# EAGLE design SparkFun_6DoF_ISM330DHCX_Qwiic_Micro_Alternate (EAGLE 9.6.2)
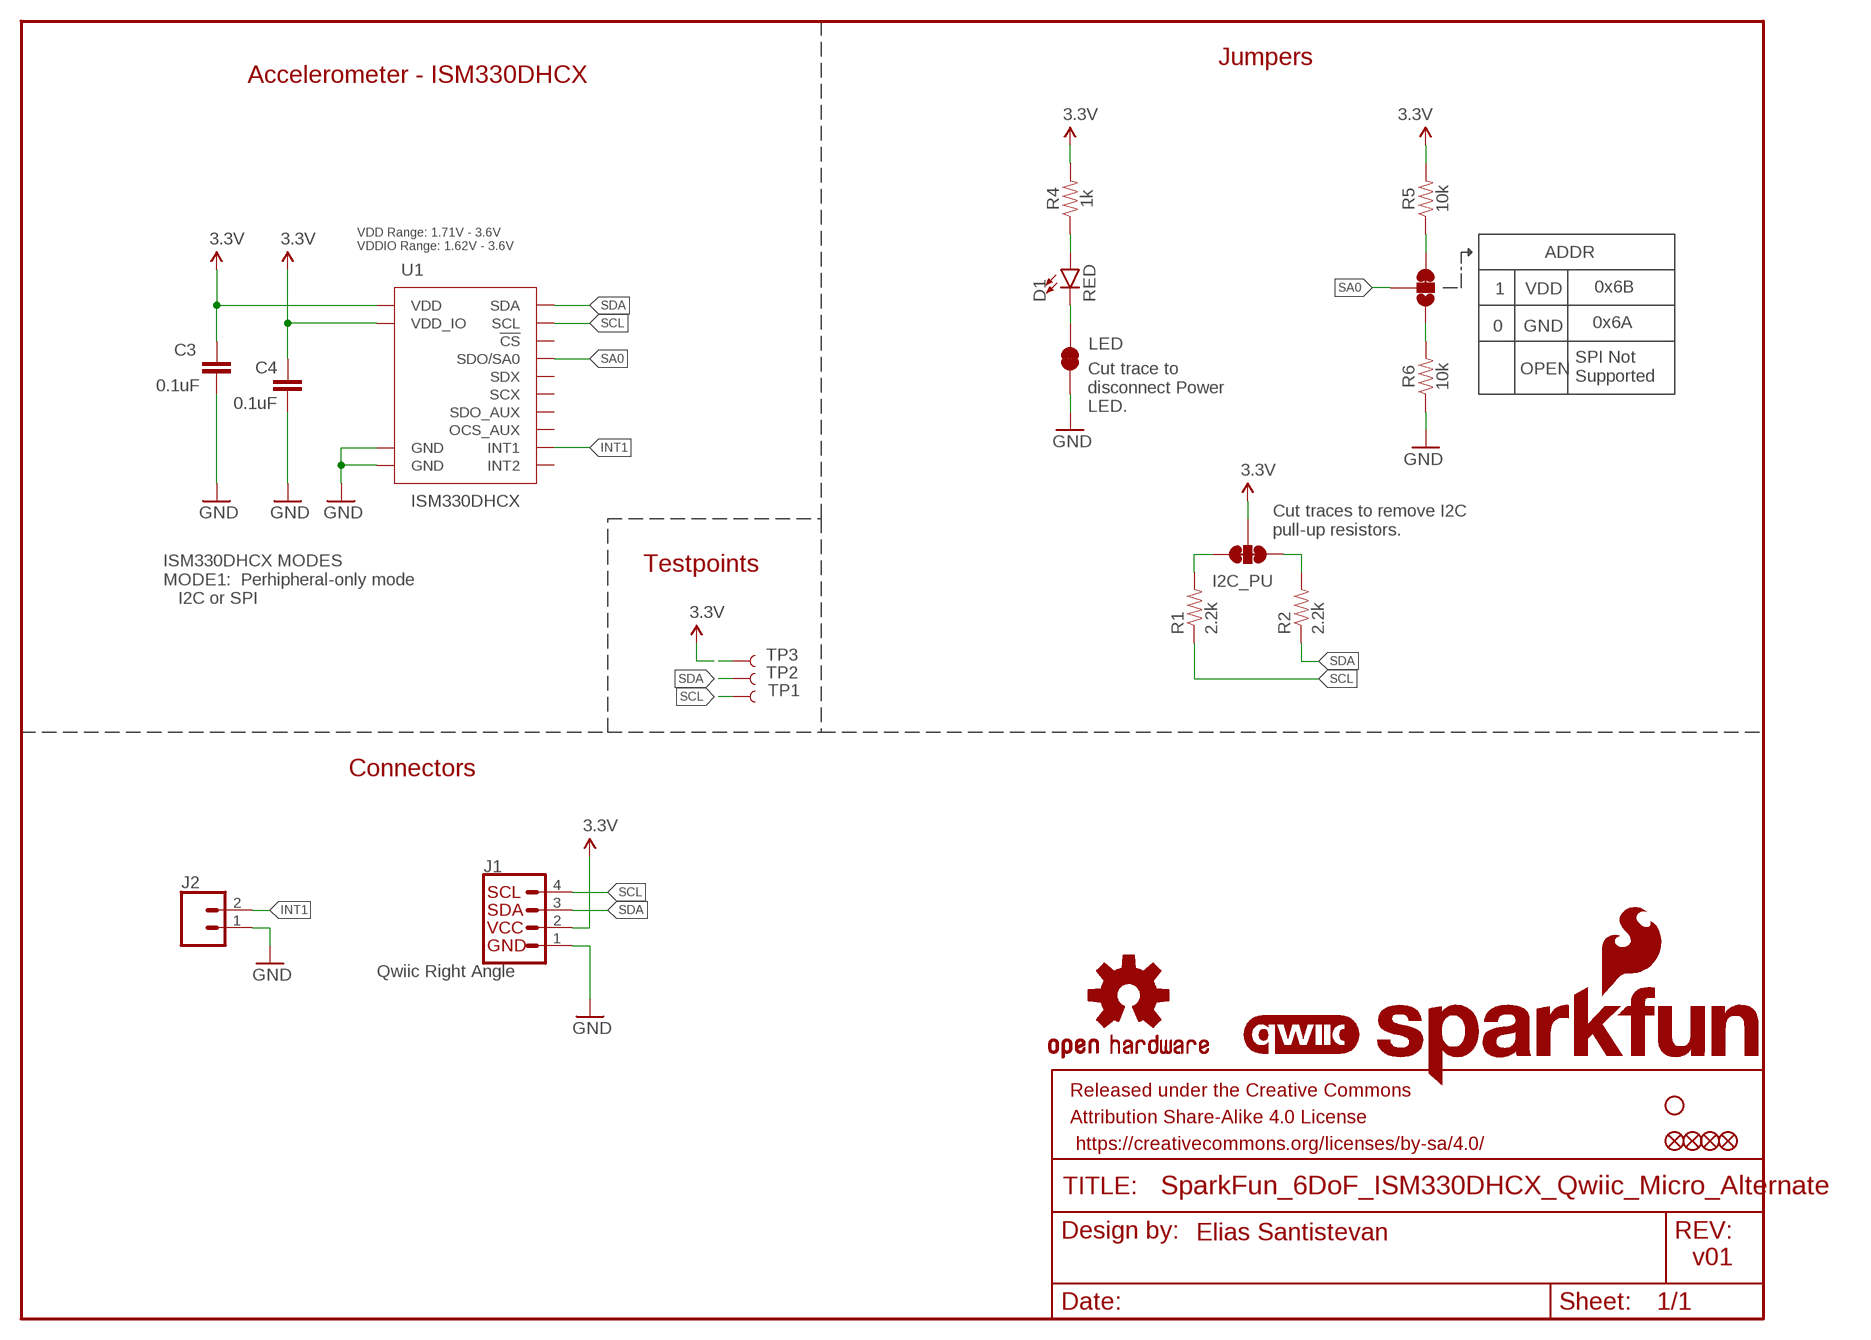
[diagram p0: schematic, sheet 1]

## Parts
ADDR  JUMPER-SMT_3_1-NC_TRACE_SILK  [SMT-JUMPER_3_1-NC_TRACE_SILK]
C3  0.1uF  0.1UF-0402T-6.3V-10%-X7R  [0402-TIGHT]
C4  0.1uF  0.1UF-0402T-6.3V-10%-X7R  [0402-TIGHT]
D1  RED  LED_0402  [0402-TIGHT]
FD1  FIDUCIALUFIDUCIAL  [FIDUCIAL-MICRO]
FD2  FIDUCIALUFIDUCIAL  [FIDUCIAL-MICRO]
FID1  FIDUCIALUFIDUCIAL  [FIDUCIAL-MICRO]
FID2  FIDUCIALUFIDUCIAL  [FIDUCIAL-MICRO]
FRAME1  FRAME-LETTER  [CREATIVE_COMMONS]
I2C_PU  S_MODE  JUMPER-SMT_3_2-NC_TRACE_SILK  [SMT-JUMPER_3_2-NC_TRACE_SILK]
J1  Qwiic Right Angle  I2C_STANDARDQWIIC  [JST04_1MM_RA]
J2  CONN_02_1.5MM  [1X02_1.5MM_NO_SILK]
LED  JUMPER-SMT_2_NC_TRACE_SILK  [SMT-JUMPER_2_NC_TRACE_SILK]
LOGO1  QWIIC_LOGO_3MM  [QWIIC_3MM]
LOGO2  OSHW-LOGOMINI  [OSHW-LOGO-MINI]
LOGO3  SFE_LOGO_NAME_FLAMEBLANK  [BLANK]
R1  2.2k  2.2KOHM-0402T-1/16W-1%  [0402-TIGHT]
R2  2.2k  2.2KOHM-0402T-1/16W-1%  [0402-TIGHT]
R4  1k  1KOHM-0402T-1/16W-1%  [0402-TIGHT]
R5  10k  10KOHM-0402T-1/16W-1%  [0402-TIGHT]
R6  10k  10KOHM-0402T-1/16W-1%  [0402-TIGHT]
STANDOFF1  STAND-OFFTIGHT  [STAND-OFF-TIGHT]
TP1  TEST-POINT3  [PAD.03X.03]
TP2  TEST-POINT3  [PAD.03X.03]
TP3  TEST-POINT3  [PAD.03X.03]
U1  ISM330DHCX  [LGA-14L]

## Nets
3.3V: C3.1 C4.1 I2C_PU.2 J1.2 R4.2 R5.2 TP3.1 U1.P5(VDD_IO) U1.P8(VDD)
GND: C3.2 C4.2 J1.1 J2.1 LED.1 R6.1 U1.P6(GND) U1.P7(GND)
INT1: J2.2 U1.P4(INT1)
N$1: ADDR.3 R5.1
N$2: D1.A R4.1
N$3: D1.C LED.2
N$5: I2C_PU.1 R1.2
N$6: I2C_PU.3 R2.2
N$7: ADDR.1 R6.2
SA0: ADDR.2 U1.P1(SDO/SA0)
SCL: J1.4 R1.1 TP1.1 U1.P13(SCL)
SDA: J1.3 R2.1 TP2.1 U1.P14(SDA)
Unconnected: U1.P2(SDX) U1.P3(SCX) U1.P9(INT2) U1.P10(OCS_AUX) U1.P11(SDO_AUX) U1.P12(!CS!)

## Notes on the sheet
- Jumpers
- Accelerometer - ISM330DHCX
- VDD Range: 1.71V - 3.6V
  VDDIO Range: 1.62V - 3.6V
- 1 | VDD | 0x6B
- 0 | GND | 0x6A
- OPEN
- SPI Not
  Supported
- Cut trace to
  disconnect Power
  LED.
- Cut traces to remove I2C
  pull-up resistors.
- ISM330DHCX MODES
  MODE1:  Perhipheral-only mode
     I2C or SPI
- Testpoints
- Connectors
- Elias Santistevan
- v01

## Library data of the parts
ADDR = SparkFun-Jumpers:JUMPER-SMT_3_1-NC_TRACE: Normally closed trace jumper (1 of 2 connections) This jumper has a trace between two pads so it's normally closed (NC). The other connection is normally open (NO). Use a razor knife to open the connection. For best results follow the IPC guidelines for cutting traces: Cutout at least 0.063 mm (0.005 in). Remove all loose material to clean up the cut area. Seal the cut with an approved epoxy. Reapply solder to reclose the connection, or to close the NO connection.
C3 C4 = SparkFun-Capacitors:0.1UF: 0.1µF ceramic capacitors A capacitor is a passive two-terminal electrical component used to store electrical energy temporarily in an electric field.; PROD_ID: CAP-14993
D1 = ISM330DHCX:LED_0402
FD1 FD2 FID1 FID2 = SparkFun-Aesthetics:FIDUCIAL: Fiducial Alignment Points Point-of-reference for pick-and-place machines and other optical instruments.
FRAME1 = SparkFun-Aesthetics:FRAME-LETTER: Schematic Frame - Letter Standard 8.5x11 US Letter frame; DESIGNER: Elias Santistevan
I2C_PU = SparkFun-Jumpers:JUMPER-SMT_3_2-NC_TRACE: Normally closed trace jumper (2 of 2 connections) This jumper has a trace between all three pads so they are normally closed (NC). Use a razor knife to open the connection(s). For best results follow the IPC guidelines for cutting traces: Cutout at least 0.063 mm (0.005 in). Remove all loose material to clean up the cut area. Seal the cut with an approved epoxy. Reapply solder to reclose the connection(s).
J1 = SparkFun-Connectors:I2C_STANDARD: SparkFun I2C Standard Pinout Header SparkFun has standardized on a pinout for all I2C based sensor breakouts. This pinout allows I2C boards to be plugged directly into the headers on Arduino Uno compatible boards, and to be daisy chained easily. Example SparkFun Products: SparkFun Atmospheric Sensor Breakout - BME280 <https://www.sparkfun.com/products/13676> SparkFun Altitude/Pressure Sensor Breakout - MPL3115A2 <https://www.sparkfun.com/products/11084> SparkFun TOF Range Finder Sensor - VL6180 <https://www.sparkfun.com/products/12785>; PROD_ID: CONN-13694
J2 = SparkFun-Connectors:CONN_02: Multi connection point. Often used as Generic Header-pin footprint for 0.1 inch spaced/style header connections On any of the 0.1 inch spaced packages, you can populate with these: Break Away Headers - Straight <https://www.sparkfun.com/products/116> (PRT-00116) Break Away Male Headers - Right Angle <https://www.sparkfun.com/products/553> (PRT-00553) Female Headers <https://www.sparkfun.com/products/115> (PRT-00115) Break Away Headers - Machine Pin <https://www.sparkfun.com/products/117> (PRT-00117) Break Away Female Headers - Swiss Machine Pin <https://www.sparkfun.com/products/743> (PRT-00743) For SCREWTERMINALS and SPRING TERMINALS visit here: Screw Terimnals on SparkFun.com <https://www.sparkfun.com/search/results?term=Screw+Terminals> (5mm/3.5mm/2.54mm spacing) This device is also useful as a general connection point to wire up your design to another part of your project. Our various solder wires solder well into these plated through hole pads. Hook-Up Wire - Assortment (Stranded, 22 AWG) <https://www.sparkfun.com/products/11375> (PRT-11375) Hook-Up Wire - Assortment (Solid Core, 22 AWG) <https://www.sparkfun.com/products/11367> (PRT-11367) View the entire wire category on our website here <https://www.sparkfun.com/categories/141> Special notes: Molex polarized connector foot print use with: PRT-08233 with associated crimp pins and housings. 2.54_SCREWTERM for use with PRT-10571. 3.5mm Screw Terminal footprints for PRT-08084 5mm Screw Terminal footprints for use with PRT-08432
LED = SparkFun-Jumpers:JUMPER-SMT_2_NC_TRACE: Normally closed trace jumper This jumper has a trace between two pads so it's normally closed (NC). Use a razor knife to open the connection. For best results follow the IPC guidelines for cutting traces: Cutout at least 0.063 mm (0.005 in). Remove all loose material to clean up the cut area. Seal the cut with an approved epoxy. Reapply solder to reclose the connection.
LOGO1 = SparkFun-Aesthetics:QWIIC_LOGO: Qwiic Logos for placement on schematic and PCB. The 5.5mm silk logo is best for placing next to Qwiic connector.
LOGO2 = SparkFun-Aesthetics:OSHW-LOGO: Open-Source Hardware (OSHW) Logo This logo indicates the piece of hardware it is found on incorporates a OSHW license and/or adheres to the definition of open source hardware found here: http://freedomdefined.org/OSHW
LOGO3 = SparkFun-Aesthetics:SFE_LOGO_NAME_FLAME: SparkFun Font Logo w/ Flame This is the SparkFun full logo. The logo on the schematic will always be the same size; the package variant is the height of the flame part of the logo. Default layer for the logo on the board is tSilk.
R1 R2 = SparkFun-Resistors:2.2KOHM: 2.2kΩ resistor A resistor is a passive two-terminal electrical component that implements electrical resistance as a circuit element. Resistors act to reduce current flow, and, at the same time, act to lower voltage levels within circuits. - Wikipedia; PROD_ID: RES-14341
R4 = SparkFun-Resistors:1KOHM: 1kΩ resistor A resistor is a passive two-terminal electrical component that implements electrical resistance as a circuit element. Resistors act to reduce current flow, and, at the same time, act to lower voltage levels within circuits. - Wikipedia; PROD_ID: RES-14342
R5 R6 = SparkFun-Resistors:10KOHM: 10kΩ resistor A resistor is a passive two-terminal electrical component that implements electrical resistance as a circuit element. Resistors act to reduce current flow, and, at the same time, act to lower voltage levels within circuits. - Wikipedia; PROD_ID: RES-14241
STANDOFF1 = SparkFun-Hardware:STAND-OFF: Stand Off Drill holes for mechanically mounting via screws, standoffs, etc. Note: Use the keepout ring to avoid running the screw head into surrounding components. Variant Overviews STAND-OFF - Mechanical footprint for a #4 phillips button head screw. STAND-OFF-TIGHT - Mechanical footprint for a #4 phillips button head screw, Example SparkFun Products Screw - Phillips Head (1/4", 4-40, 10 pack) <https://www.sparkfun.com/products/10453> (PRT-10453) Screw - Phillips Head (1/2", 4-40, 10 pack) <https://www.sparkfun.com/products/10452> (PRT-10452) Screw - Phillips Head (3/4", 4-40, 10 pack) <https://www.sparkfun.com/products/10451> (PRT-10451) Screw - Phillips Head (1", 4-40, 10 pack) <https://www.sparkfun.com/products/10450> (PRT-10450)
TP1-TP3 = SparkFun-Connectors:TEST-POINT: SparkFun Test Points Bare copper test points for troubleshooting or In-Circuit-Testing. These are used by our Production team for verifying production board runs using pogo-pins on test beds. SparkFun Products: SparkFun LSM9DS1 Breakout <https://www.sparkfun.com/products/13284> SparkFun PSOC <https://www.sparkfun.com/products/13714> SparkFun Load Cell Amplifier <https://www.sparkfun.com/products/13879>
U1 = ISM330DHCX:ISM330DHCX: ISM330DHCX 6DoF The ISM330DHCX is a system-in-package featuring a high-performance 3D digital accelerometer and 3D digital gyroscope tailored for Industry 4.0 applications.; PROD_ID: IC-16693

## Board
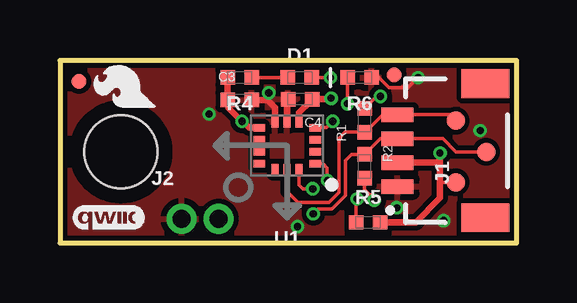
[diagram p1: board, top side]
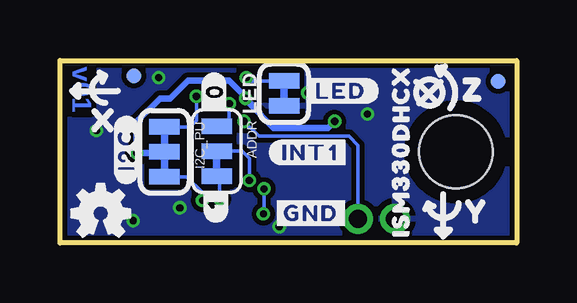
[diagram p2: board, bottom side, seen from below]

Size 19.05 x 7.62 mm. Coordinates in mm from the lower left corner, seen from the top.
Outline: 19.05,7.62 0,7.62 0,0 19.05,0 19.05,7.62
Copper layers (1*16): Top 0.035mm / dielectric 1.5mm / Bottom 0.035mm
Design rules "SparkFun-2-Layer-Minimum-JLCPCB": minimum track width 5mil, minimum drill 0.3mm, track to track 5mil, track to pad 5mil, pad to pad 5mil, via to via 5mil, smd to smd 5mil, copper to edge 7mil, drill to drill 7mil, minimum pad ring 5mil, minimum via ring 5mil, stop-mask expansion 2.5mil, vias tented up to drill 25mil, thermal gap 10mil
tRestrict: area 9.2,5 to 9.2,5.2

### Footprints (pad centres in the part's own frame; a part is rotated, then mirrored left to right if it is on the bottom)
SMT-JUMPER_3_1-NC_TRACE_SILK = smd 0.66 x 1.27: 1 -1.041,0; 2 0,0; 3 1.041,0
0402-TIGHT = smd 0.6 x 0.6: 1 -0.5,0; 2 0.5,0
0402-TIGHT' = smd 0.6 x 0.6: A -0.5,0; C 0.5,0
FIDUCIAL-MICRO = smd 0.635 x 0.635: 1 0,0
SMT-JUMPER_3_2-NC_TRACE_SILK = smd 0.66 x 1.27: 1 -1.041,0; 2 0,0; 3 1.041,0
JST04_1MM_RA = smd 0.6 x 1.35: 1 -1.5,0; 2 -0.5,0; 3 0.5,0; 4 1.5,0 | smd 1.2 x 2: NC1 2.8,-3.675; NC2 -2.8,-3.675
1X02_1.5MM_NO_SILK = drill 0.75 pad 1.25: 1 0,0; 2 1.54,0
SMT-JUMPER_2_NC_TRACE_SILK = smd 0.66 x 1.27: 1 -0.521,0; 2 0.521,0
STAND-OFF-TIGHT = hole 3.048: 0,0
PAD.03X.03 = smd 0.762 x 0.762: 1 0,0
LGA-14L = smd 0.48 x 0.3: P1 -1.163,0.75; P2 -1.163,0.25; P3 -1.163,-0.25; P4 -1.163,-0.75; P8 1.163,-0.75; P9 1.163,-0.25; P10 1.163,0.25; P11 1.163,0.75 | smd 0.3 x 0.48: P5 -0.5,-1; P6 0,-1; P7 0.5,-1; P12 0.5,1; P13 0,1; P14 -0.5,1

### Placement (x,y rotation side)
ADDR  12.52,3.84 270 bottom
C3  7.49,5.98 0 top
C4  10.02,6 180 top
D1  RED  [0402-TIGHT']  10.01,6.91 0 top
FD1  15.98,6.99 0 bottom
FD2  0.79,6.76 0 bottom
FID1  13.94,7.01 0 top
FID2  0.79,6.76 0 top
FRAME1  -19.05,-11.43 0 top  (outside the outline)
I2C_PU  14.69,3.81 270 bottom
J1  14.07,3.86 90 top
J2  5.08,1.02 0 top
LED  9.7,6.25 90 bottom
LOGO1  2.03,1.07 0 top
LOGO2  17.35,1.25 0 bottom
LOGO3  -39.37,-15.24 0 top  (outside the outline)
R1  12.71,5.13 90 top
R2  12.71,3.2 270 top
R4  7.49,6.91 180 top
R5  12.85,0.86 0 top
R6  12.5,6.91 180 top
STANDOFF1  2.54,3.81 0 top
TP1  16.51,5.11 0 top
TP2  17.78,3.81 0 top
TP3  16.51,2.54 0 top
U1  9.47,4.06 180 top
U$1  [#1#2121]  12.55,1.63 90 bottom
U$2  [#0#2121]  12.62,6.25 270 bottom
U$3  [#LED#2121]  7.34,6.35 0 bottom
U$4  [#INT1#112]  8.61,3.78 0 bottom
U$5  [#GND#5]  8.59,1.24 0 bottom
U$6  [ISM330DHCX2120]  4.83,3.84 90 bottom
U$7  [X2114]  17.2,5.11 0 bottom
U$8  [Y2115]  1.65,1.32 0 bottom
U$9  [Z2116]  1.8,6.4 0 bottom
U$25  [#I2C#11]  16.28,3.89 90 bottom
U$29  [SFE_LOGO_FLAME_.1]  2.67,6.53 90 top

### Tracks (layer width: path | path; a pad name or v marks a point on that pad's centre or on a via)
3.3V  (via drill 0.3)
  Top 0.152: 15.85,2.54 TP3.1
  Top 0.279: U1.P5 9.97,5.45 10.44,5.92 10.6,5.92 10.68,6 11.26,6 v11.31,6.04 | R4.2 C3.1 7.04,5.93 7.04,5.64 v7.59,5.08 7.61,5.08 7.88,4.81 U1.P8 | v15.85,3.76 15.85,3.38 | 15.85,3.38 15.85,2.54 15.85,1.88 14.83,0.86 R5.2 | 15.85,3.38 15.83,3.36 J1.2
  Top 0.305: C4.1 10.68,6
  Bottom 0.279: I2C_PU.2 14.74,3.76 v15.85,3.76 v15.84,3.77 15.84,5.06 14.87,6.03 14.46,6.03 13.72,6.78 11.99,6.78 11.31,6.1 v11.31,6.04 11.11,5.84 11.11,5.77 10.13,4.8 7.87,4.8 v7.59,5.08
GND  (via drill 0.3)
  Top 0.152: R6.1 13.31,6.91 13.73,6.49 14.52,6.49 v14.94,6.91
  Top 0.279: U1.P6 9.47,5.96 C4.2 | U1.P7 8.97,5.66 8.65,5.97 C3.2
  other vias: 14.05,1.47 9.91,0.69 6.22,5.38 17.53,4.7 8.71,6.27 16,0.94
  pour Bottom (isolate 0.203): 19.05,0 19.05,7.62 0,7.62 0,0
  pour Top (isolate 0.203, rank 2): 19.05,0 19.05,7.62 0,7.62 0,0
INT1  (via drill 0.3)
  Top 0.152: U1.P4 11.11,4.81 v11.38,5.08
  Bottom 0.152: v11.38,5.08 10.75,4.46 7,4.46 6.62,4.08 J2.2
N$1  (via drill 0.3)
  Top 0.152: R5.1 12.35,1.8 v12.39,1.84
  Bottom 0.152: v12.39,1.84 12.39,2.67 ADDR.3
N$2
  Top 0.152: D1.A R4.1
N$3  (via drill 0.3)
  Top 0.152: D1.C v11.28,6.91
  Bottom 0.152: v11.28,6.91 11.14,6.77 LED.2
N$5  (via drill 0.3)
  Top 0.152: R1.2 13.2,6.12 v13.36,6.12
  Bottom 0.152: v13.36,6.12 13.36,5.11 13.61,4.85 I2C_PU.1
N$6  (via drill 0.3)
  Top 0.152: R2.2 12.71,2.24 13.11,1.84 v13.11,1.78
  Bottom 0.152: v13.11,1.78 13.11,2.11 13.77,2.77 I2C_PU.3
N$7  (via drill 0.3)
  Top 0.152: R6.2 v12,5.83 v11.99,5.82
  Bottom 0.152: v11.99,5.82 11.99,5.02 12.13,4.88 ADDR.1
SA0  (via drill 0.3)
  Top 0.152: v11.15,2.62 v11.14,2.63 11.14,3.14 10.97,3.31 U1.P1
  Bottom 0.152: v11.15,2.62 11.15,3.53 11.46,3.83 ADDR.2
SCL
  Top 0.152: U1.P13 9.47,2.16 9.93,1.7 11.23,1.7 11.63,2.11 11.63,4.37 11.89,4.63 R1.1 12.75,4.63 13.48,5.36 J1.4 16.25,5.36 TP1.1
SDA  (via drill 0.3)
  Top 0.152: U1.P14 9.97,2.42 10.13,2.27 v10.54,2.27 | v10.57,1.22 10.77,1.42 11.34,1.42 11.91,1.99 11.91,3.45 12.16,3.7 R2.1 13.37,4.36 J1.3 15.96,4.36 16.51,3.81 TP2.1
  Bottom 0.152: v10.57,1.22 10.54,1.25 v10.54,2.27

### Text on the board
Bottom: v01